# EAGLE board AK4493-v1.64_26 (EAGLE 9.6.2), part 1 of 2
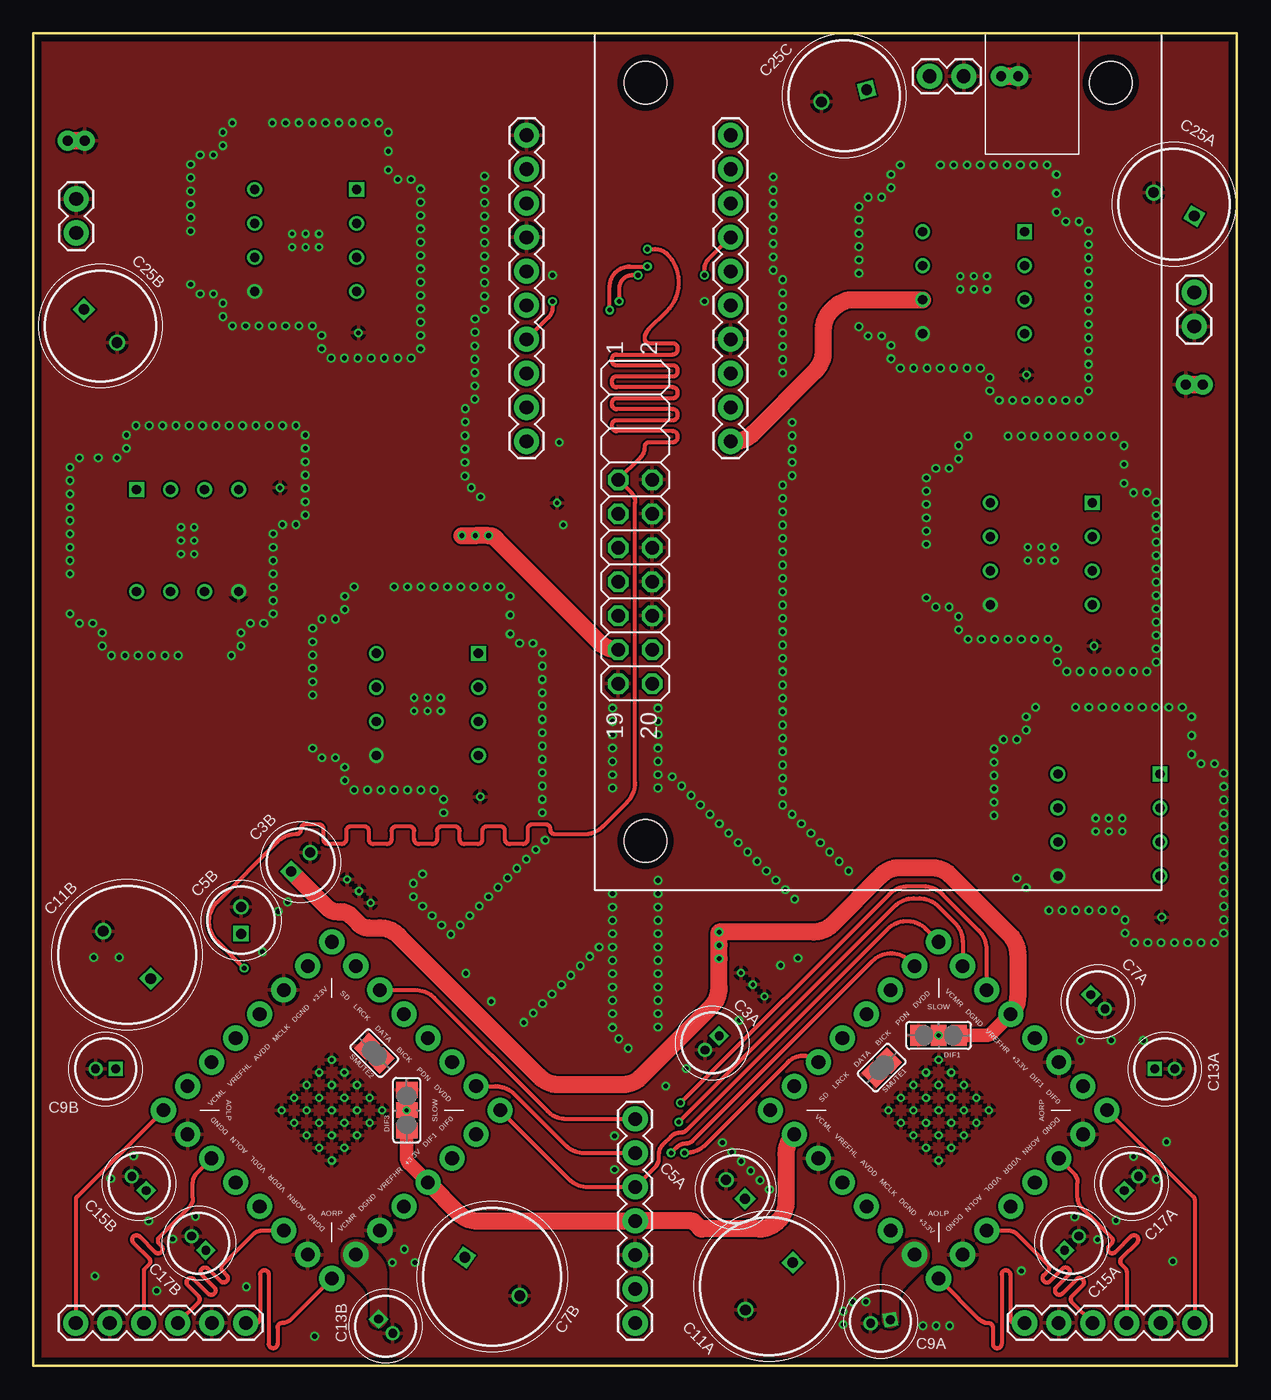
[diagram p2: board, top side]
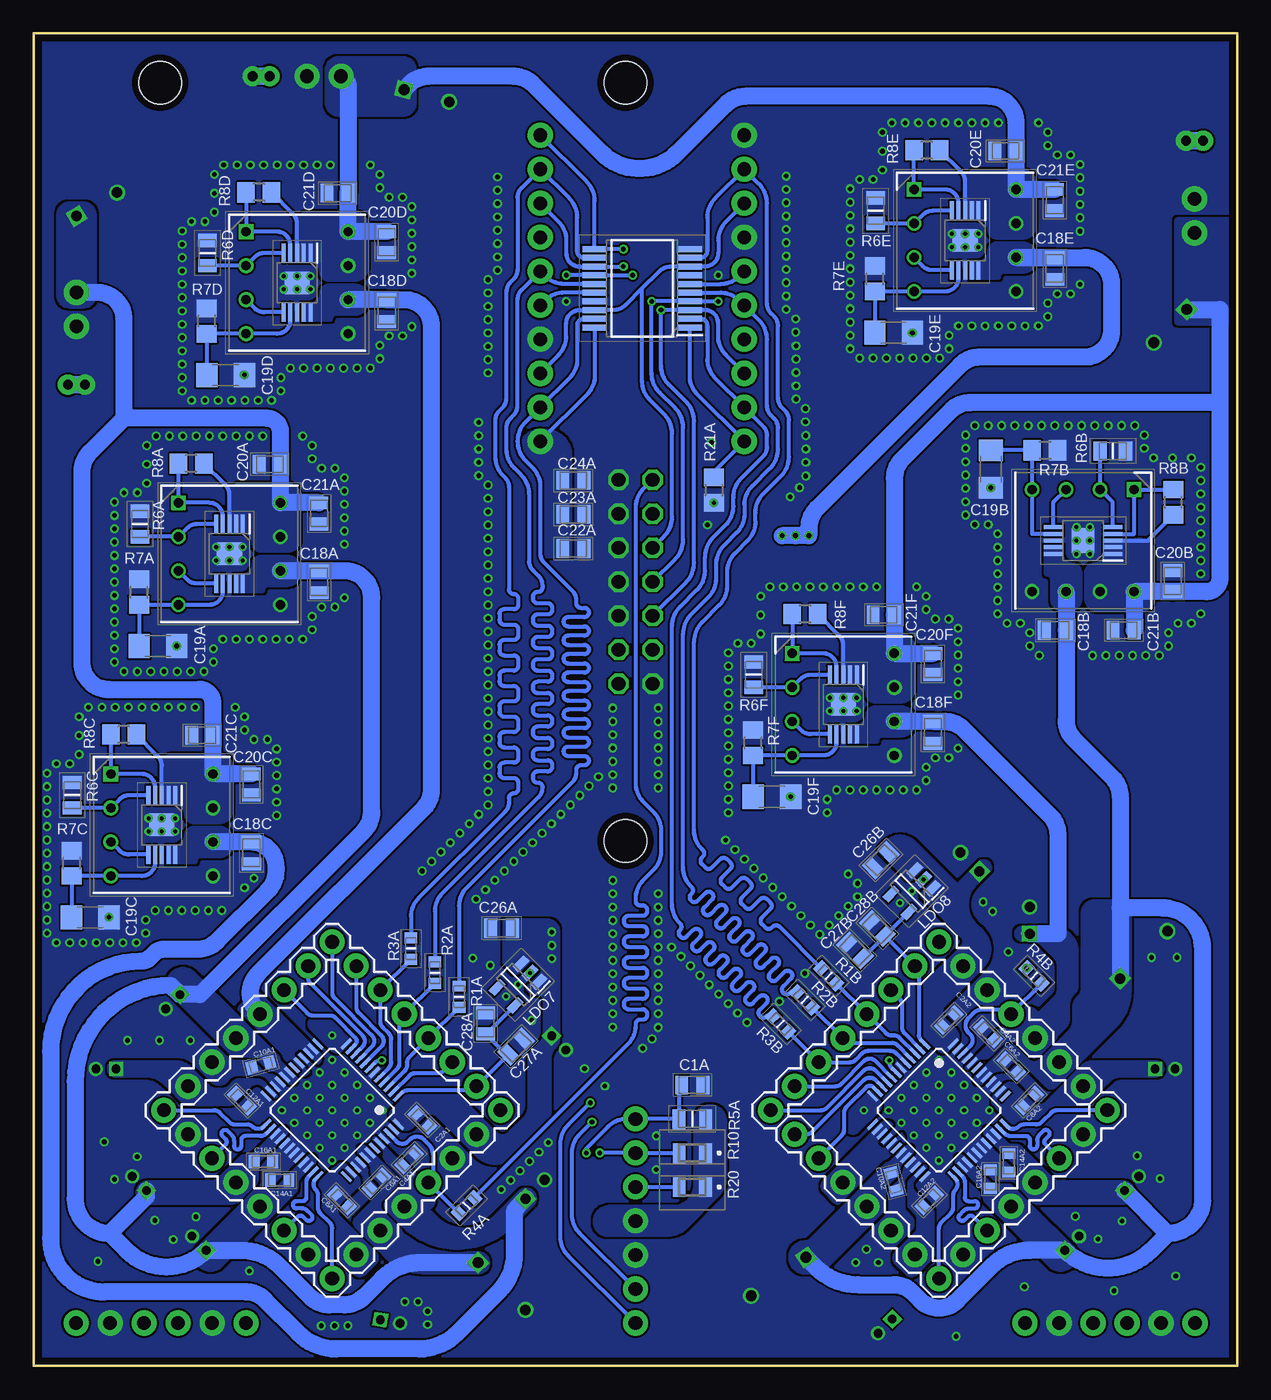
[diagram p3: board, bottom side, seen from below]

Size 89.89 x 99.5 mm. Coordinates in mm from the lower left corner, seen from the top.
Outline: 0,99.5 89.89,99.5 89.89,0 0,0 0,99.5
Copper layers (1*16): Top 0.035mm / dielectric 1.6mm / Bottom 0.035mm
Design rules "Elecrow_2-layer_PCB_eagle_rule": minimum track width 6mil, minimum drill 12mil, track to track 6mil, track to pad 6mil, pad to pad 6mil, via to via 8mil, smd to smd 0mil, copper to edge 20mil, drill to drill 10mil, minimum pad ring 6mil, minimum via ring 6mil, stop-mask expansion 0mil, vias tented up to drill 100mil, thermal gap 10mil
Net classes: 3 Power: width 1.27 mm, drill 1.27 mm, clearance 0.254 mm

## Footprints (pad centres in the part's own frame; a part is rotated, then mirrored left to right if it is on the bottom)
I2SOVERUSBV3 = drill 1.016 octagon: H3.7 33.322,1.745; H3.8 33.322,4.285; H3.9 35.862,1.745; H3.10 35.862,4.285; H3.11 38.403,1.745; H3.12 38.403,4.285; H3.13 40.943,1.745; H3.14 40.943,4.285; H3.15 43.483,1.745; H3.16 43.483,4.285; H3.17 46.023,1.745; H3.18 46.023,4.285; H3.19 48.562,1.745; H3.20 48.562,4.285 | hole 3.175: 3.688,3.775; 3.688,38.525; 60.312,3.775
CAPC2012X135N = smd 0.96 x 1.39: 1 -0.79,0; 2 0.79,0
CAPC1608X95N = smd 0.81 x 0.99: 1 -0.69,0; 2 0.69,0
CAPPRD150W45D450H600 = drill 0.65 pad 1.05 square: 1 0,0 | drill 0.65 pad 1.05: 2 1.5,0
CAPPRD200W55D500H800 = drill 0.75 pad 1.15 square: 1 0,0 | drill 0.75 pad 1.15: 2 2,0
CAPPRD500W60D1025H2150 = drill 0.8 pad 1.2 square: 1 0,0 | drill 0.8 pad 1.2: 2 5,0
CAPC2013X140N = smd 0.96 x 1.44: 1 -0.82,0; 2 0.82,0
C1206 = smd 1.6 x 1.8: 1 -1.4,0; 2 1.4,0 | drill 0.35: DGND 1.4,0
CAPPRD350W60D825H1300 = drill 0.8 pad 1.2 square: 1 0,0 | drill 0.8 pad 1.2: 2 3.5,0
SJ_2 = smd 1.168 x 1.6: 1 -1.524,0; 2 0,0; 3 1.524,0
SOP50P490X110-11N = smd 1.425 x 0.3: 1 -2.212,1; 2 -2.212,0.5; 3 -2.212,0; 4 -2.212,-0.5; 5 -2.212,-1; 6 2.212,-1; 7 2.212,-0.5; 8 2.212,0; 9 2.212,0.5; 10 2.212,1 | smd 1.68 x 1.88: 11 0,0 | drill 0.305 pad 0.61: P$1 -0.498,0; P$2 0.498,0; P$3 -0.498,0.995; P$4 0.498,0.995; P$5 -0.498,-0.995; P$6 0.498,-0.995
LQFP48_ = smd 0.25 x 1: 1 -2.75,-4.25; 2 -2.25,-4.25; 3 -1.75,-4.25; 4 -1.25,-4.25; 5 -0.75,-4.25; 6 -0.25,-4.25; 7 0.25,-4.25; 8 0.75,-4.25; 9 1.25,-4.25; 10 1.75,-4.25; 11 2.25,-4.25; 12 2.75,-4.25; 25 2.75,4.25; 26 2.25,4.25; 27 1.75,4.25; 28 1.25,4.25; 29 0.75,4.25; 30 0.25,4.25; 31 -0.25,4.25; 32 -0.75,4.25; 33 -1.25,4.25; 34 -1.75,4.25; 35 -2.25,4.25; 36 -2.75,4.25 | smd 1 x 0.25: 13 4.25,-2.75; 14 4.25,-2.25; 15 4.25,-1.75; 16 4.25,-1.25; 17 4.25,-0.75; 18 4.25,-0.25; 19 4.25,0.25; 20 4.25,0.75; 21 4.25,1.25; 22 4.25,1.75; 23 4.25,2.25; 24 4.25,2.75; 37 -4.25,2.75; 38 -4.25,2.25; 39 -4.25,1.75; 40 -4.25,1.25; 41 -4.25,0.75; 42 -4.25,0.25; 43 -4.25,-0.25; 44 -4.25,-0.75; 45 -4.25,-1.25; 46 -4.25,-1.75; 47 -4.25,-2.25; 48 -4.25,-2.75 | drill 0.305 pad 0.61: P$1 0,0; P$2 -1.327,0; P$3 -2.655,0; P$4 1.327,0; P$5 2.655,0; P$6 0,1.327; P$7 0,2.655; P$8 0,-1.327; P$9 0,-2.655; P$10 -1.327,-1.327; P$11 -2.655,-1.327; P$12 -2.655,-2.655; P$13 -1.327,-2.655; P$14 1.327,-2.655; P$15 2.655,-2.655; P$16 2.655,-1.327; P$17 1.327,-1.327; P$18 1.327,1.327; P$19 2.655,1.327; P$20 2.655,2.655; P$21 1.327,2.655; P$22 -1.327,2.655; P$23 -2.655,2.655; P$24 -2.655,1.327; P$25 -1.327,1.327
SOP65P780X200-20N = smd 1.8 x 0.45: 1 -3.55,2.925; 2 -3.55,2.275; 3 -3.55,1.625; 4 -3.55,0.975; 5 -3.55,0.325; 6 -3.55,-0.325; 7 -3.55,-0.975; 8 -3.55,-1.625; 9 -3.55,-2.275; 10 -3.55,-2.925; 11 3.55,-2.925; 12 3.55,-2.275; 13 3.55,-1.625; 14 3.55,-0.975; 15 3.55,-0.325; 16 3.55,0.325; 17 3.55,0.975; 18 3.55,1.625; 19 3.55,2.275; 20 3.55,2.925
1X02 = drill 1.016 pad 1.88: 1 0,0; 2 2.54,0
1X07 = drill 1.016 pad 1.88: 1 0,0; 2 2.54,0; 3 5.08,0; 4 7.62,0; 5 10.16,0; 6 12.7,0; 7 15.24,0
1X06 = drill 1.016 pad 1.88: 1 0,0; 2 2.54,0; 3 5.08,0; 4 7.62,0; 5 10.16,0; 6 12.7,0
DIPS762W51P254L1016H390Q8N = drill 0.7 pad 1.1 square: 1 0,0 | drill 0.7 pad 1.1: 2 0,-2.54; 3 0,-5.08; 4 0,-7.62; 5 7.62,-7.62; 6 7.62,-5.08; 7 7.62,-2.54; 8 7.62,0
1X10 = drill 1.016 pad 1.88: 1 0,0; 2 2.54,0; 3 5.08,0; 4 7.62,0; 5 10.16,0; 6 12.7,0; 7 15.24,0; 8 17.78,0; 9 20.32,0; 10 22.86,0
SOT95P280X145-5N = smd 1.2 x 0.6: 1 -1.25,0.95; 2 -1.25,0; 3 -1.25,-0.95; 4 1.25,-0.95; 5 1.25,0.95 | drill 0.305 pad 0.61: DGND -1.25,0; DGND2 0,0; DGND3 1.25,0
RESC1608X55N = smd 0.8 x 0.95: 1 -0.8,0; 2 0.8,0
RESC2012X50N = smd 0.95 x 1.45: 1 -1,0; 2 1,0
RESC2012X60N = smd 1 x 1.4: 1 -0.95,0; 2 0.95,0
R0805 = smd 1.3 x 1.5: 1 -0.95,0; 2 0.95,0
RCS0805_E3 = smd 0.95 x 1.45: 1 -0.975,0; 2 0.975,0
R0805-POL = smd 1.3 x 1.5: 1 -0.95,0; 2 0.95,0 | drill 0.305 pad 0.61: DGND 0.95,0
SHORT_ALL-50 = drill 0.737 pad 1.524: 1 -0.635,0; 2 0.635,0
SJ = smd 1.168 x 1.6: 1 -0.762,0; 2 0.762,0

## Placement (x,y rotation side)
BD1  I2SOVERUSBV3  [I2SOVERUSBV3]  41.93,99.5 270 top
C1A  0.1uF, X7R  [CAPC2012X135N]  40.7,20.97 0 bottom
C2A1  0.1u, Ceramic Capacitor X7R  [CAPC1608X95N]  60.87,18.35 315 bottom
C2A2  0.1u, Ceramic Capacitor X7R  [CAPC1608X95N]  21.55,25.82 45 bottom
C3A  80-A758BG106M1EAAE70  [CAPPRD150W45D450H600]  51.21,24.63 225 top
C3B  80-A758BG106M1EAAE70  [CAPPRD200W55D500H800]  19.25,36.9 45 top
C4A1  0.1u, Ceramic Capacitor X7R  [CAPC1608X95N]  61.86,15.42 45 bottom
C4A2  0.1u, Ceramic Capacitor X7R  [CAPC1608X95N]  18.62,24.83 135 bottom
C5A  80-A758BG106M1EAAE70  [CAPPRD200W55D500H800]  53.15,12.47 135 top
C5B  80-A758BG106M1EAAE70  [CAPPRD200W55D500H800]  15.5,32.26 90 top
C6A1  0.1u, Ceramic Capacitor X7R  [CAPC1608X95N]  64.3,13.68 225 bottom
C6A2  0.1u, Ceramic Capacitor X7R  [CAPC1608X95N]  16.88,22.39 315 bottom
C7A  RNU1A100MDSASQ  [CAPPRD150W45D450H600]  78.97,27.72 315 top
C7B  APSG160ELL222MJ20S  [CAPPRD500W60D1025H2150]  32.22,8.09 325 top
C8A1  0.1u, Ceramic Capacitor X7R  [CAPC1608X95N]  66.88,12.34 315 bottom
C8A2  0.1u, Ceramic Capacitor X7R  [CAPC1608X95N]  15.54,19.81 45 bottom
C9A  647-RNU1A100MDSASQ  [CAPPRD150W45D450H600]  64,3.44 190 top
C9B  647-RNU1A100MDSASQ  [CAPPRD150W45D450H600]  6.14,22.17 180 top
C10A1  0.1u, Ceramic Capacitor X7R  [CAPC1608X95N]  72.93,22.46 195 bottom
C10A2  0.1u, Ceramic Capacitor X7R  [CAPC1608X95N]  25.66,13.75 285 bottom
C11A  APSG160ELL222MJ20S  [CAPPRD500W60D1025H2150]  56.71,7.7 225 top
C11B  2200uF, 10V  [CAPPRD500W60D1025H2150]  8.75,28.92 135 top
C12A1  0.1u, Ceramic Capacitor X7R  [CAPC1608X95N]  74.34,19.8 315 bottom
C12A2  0.1u, Ceramic Capacitor X7R  [CAPC1608X95N]  23.01,12.34 45 bottom
C13A  647-RNU1A100MDSASQ  [CAPPRD150W45D450H600]  83.75,22.17 0 top
C13B  647-RNU1A100MDSASQ  [CAPPRD150W45D450H600]  25.77,3.49 315 top
C14A1  0.1u, Ceramic Capacitor X7R  [CAPC1608X95N]  71.53,13.86 180 bottom
C14A2  0.1u, Ceramic Capacitor X7R  [CAPC1608X95N]  17.06,15.15 270 bottom
C15A  647-RNU1A100MDSASQ  [CAPPRD150W45D450H600]  77.01,8.62 45 top
C15B  647-RNU1A100MDSASQ  [CAPPRD150W45D450H600]  8.41,13.08 135 top
C16A1  0.1u, Ceramic Capacitor X7R  [CAPC1608X95N]  72.74,15.24 0 bottom
C16A2  0.1u, Ceramic Capacitor X7R  [CAPC1608X95N]  18.45,13.95 90 bottom
C17A  647-RNU1A100MDSASQ  [CAPPRD150W45D450H600]  81.48,13.08 45 top
C17B  647-RNU1A100MDSASQ  [CAPPRD150W45D450H600]  12.88,8.62 135 top
C18A  4.7u  [CAPC2013X140N]  68.58,58.55 270 bottom
C18B  4.7u  [CAPC2013X140N]  13.6,54.93 180 bottom
C18C  4.7u  [CAPC2013X140N]  73.63,38.3 270 bottom
C18D  4.7u  [CAPC2013X140N]  63.53,78.8 270 bottom
C18E  4.7u  [CAPC2013X140N]  13.63,81.95 270 bottom
C18F  4.7u  [CAPC2013X140N]  22.73,47.3 270 bottom
C19A  22u  [C1206]  80.62,53.74 0 bottom
C19B  22u  [C1206]  18.41,66.97 270 bottom
C19C  22u  [C1206]  85.67,33.49 0 bottom
C19D  22u  [C1206]  75.57,73.99 0 bottom
C19E  22u  [C1206]  25.67,77.14 0 bottom
C19F  22u  [C1206]  34.77,42.49 0 bottom
C20A  10u  [CAPC2012X135N]  72.26,67.33 180 bottom
C20B  10u  [CAPC2012X135N]  4.82,58.61 90 bottom
C20C  10u  [CAPC2012X135N]  73.63,43.41 270 bottom
C20D  10u  [CAPC2012X135N]  63.53,83.91 270 bottom
C20E  10u  [CAPC2012X135N]  17.31,90.73 180 bottom
C20F  10u  [CAPC2012X135N]  22.73,52.41 270 bottom
C21A  0.1u  [CAPC2012X135N]  68.58,63.66 270 bottom
C21B  0.1u  [CAPC2012X135N]  8.49,54.93 180 bottom
C21C  0.1u  [CAPC2012X135N]  77.31,47.08 180 bottom
C21D  0.1u  [CAPC2012X135N]  67.21,87.58 180 bottom
C21E  0.1u  [CAPC2012X135N]  13.63,87.06 270 bottom
C21F  0.1u  [CAPC2012X135N]  26.41,56.08 180 bottom
C22A  0.1u, Ceramic Capacitor X7R  [CAPC2012X135N]  49.59,61.03 0 bottom
C23A  0.1u, Ceramic Capacitor X7R  [CAPC2012X135N]  49.59,63.57 0 bottom
C24A  0.1u, Ceramic Capacitor X7R  [CAPC2012X135N]  49.59,66.11 0 bottom
C25A  470u  [CAPPRD350W60D825H1300]  86.7,85.87 150 top
C25B  470u  [CAPPRD350W60D825H1300]  3.77,78.89 315 top
C25C  470u  [CAPPRD350W60D825H1300]  62.24,95.3 195 top
C26A  4.7u, Ceramic Capacitor X7R  [CAPC2013X140N]  54.96,32.68 180 bottom
C26B  4.7u, Ceramic Capacitor X7R  [CAPC2013X140N]  26.62,37.76 225 bottom
C27A  4.7u, Ceramic Capacitor X7R  [CAPC2013X140N]  53.87,23.84 45 bottom
C27B  4.7u, Ceramic Capacitor X7R  [CAPC2013X140N]  28.55,31.02 135 bottom
C28A  0.1u, Ceramic Capacitor X7R  [CAPC2012X135N]  56.14,25.57 90 bottom
C28B  0.1u, Ceramic Capacitor X7R  [CAPC2012X135N]  26.87,32.66 135 bottom
DIF1  [SJ_2]  67.61,24.67 0 top
DIF3  [SJ_2]  27.88,19.08 270 top
IC1  LT3042  [SOP50P490X110-11N]  75.28,60.64 270 bottom
IC2  AK4493  [LQFP48_]  67.61,19.08 135 bottom
IC3  AK4493  [LQFP48_]  22.28,19.08 225 bottom
IC4  LT3042  [SOP50P490X110-11N]  80.33,40.39 270 bottom
IC4A  SN74ABT273DBR  [SOP65P780X200-20N]  44.44,80.47 180 bottom
IC5  LT3042  [SOP50P490X110-11N]  11.51,61.63 180 bottom
IC6  LT3042  [SOP50P490X110-11N]  70.23,80.89 270 bottom
IC7  LT3042  [SOP50P490X110-11N]  29.43,49.39 270 bottom
IC8  LT3042  [SOP50P490X110-11N]  20.33,84.04 270 bottom
J1  [1X02]  3.19,84.6 90 top
J2  [1X02]  66.94,96.31 0 top
J3  [1X07]  44.94,18.43 270 top
J4  [1X06]  74.03,3.19 0 top
J5  [1X07]  80.18,19.08 45 bottom
J6  [1X07]  67.61,6.51 135 bottom
J7  [1X07]  55.03,19.08 225 bottom
J8  [1X07]  67.61,31.65 315 bottom
J9  [1X07]  22.28,6.51 135 bottom
J10  [1X07]  9.71,19.08 225 bottom
J11  [1X07]  22.28,31.65 315 bottom
J12  [1X07]  34.85,19.08 45 bottom
J13  [1X06]  3.16,3.19 0 top
J14  [1X02]  86.7,80.16 270 top
J15  XR2A-0811-N  [DIPS762W51P254L1016H390Q8N]  79.09,64.45 0 bottom
J16  XR2A-0811-N  [DIPS762W51P254L1016H390Q8N]  84.14,44.2 0 bottom
J17  XR2A-0811-N  [DIPS762W51P254L1016H390Q8N]  7.7,65.44 270 bottom
J18  XR2A-0811-N  [DIPS762W51P254L1016H390Q8N]  74.04,84.7 0 bottom
J19  XR2A-0811-N  [DIPS762W51P254L1016H390Q8N]  33.24,53.2 0 bottom
J20  XR2A-0811-N  [DIPS762W51P254L1016H390Q8N]  24.14,87.85 0 bottom
J21  [1X10]  36.82,91.9 270 top
J22  [1X10]  52.06,69.04 90 top
LDO7  LP5907-1.8V  [SOT95P280X145-5N]  53.72,28.46 225 bottom
LDO8  LP5907-1.8V  [SOT95P280X145-5N]  24.31,35.44 225 bottom
R1A  RT0603DRE075R1L  [RESC1608X55N]  58.13,27.56 270 bottom
R1B  RT0603DRE075R1L  [RESC1608X55N]  30.53,29.12 315 bottom
R2A  RT0603DRE075R1L  [RESC1608X55N]  59.93,29.35 270 bottom
R2B  RT0603DRE075R1L  [RESC1608X55N]  32.32,27.32 315 bottom
R3A  RT0603DRE075R1L  [RESC1608X55N]  61.72,31.15 270 bottom
R3B  RT0603DRE075R1L  [RESC1608X55N]  34.12,25.53 315 bottom
R4A  RT0603DRE075R1L  [RESC1608X55N]  57.57,11.96 225 bottom
R4B  RT0603DRE075R1L  [RESC1608X55N]  15.17,29.12 315 bottom
R5A  10K, Resistor 1%  [RESC2012X50N]  40.7,18.43 0 bottom
R6A  1k  [RESC2012X60N]  81.97,62.86 90 bottom
R6B  1k  [RESC2012X60N]  9.29,68.32 0 bottom
R6C  1k  [RESC2012X60N]  87.02,42.61 90 bottom
R6D  1k  [RESC2012X60N]  76.92,83.11 90 bottom
R6E  1k  [RESC2012X60N]  27.02,86.26 90 bottom
R6F  1k  [RESC2012X60N]  36.12,51.61 90 bottom
R7A  33k  [R0805]  82.02,57.78 90 bottom
R7B  33k  [R0805]  14.37,68.37 0 bottom
R7C  33k  [R0805]  87.07,37.53 90 bottom
R7D  33k  [R0805]  76.97,78.03 90 bottom
R7E  33k  [R0805]  27.07,81.18 90 bottom
R7F  33k  [R0805]  36.17,46.53 90 bottom
R8A  200k  [R0805]  78.14,67.38 180 bottom
R8B  200k  [R0805]  4.77,64.49 90 bottom
R8C  200k  [R0805]  83.19,47.13 180 bottom
R8D  200k  [R0805]  73.09,87.63 180 bottom
R8E  200k  [R0805]  23.19,90.78 180 bottom
R8F  200k  [R0805]  32.29,56.13 180 bottom
R10  2.2k, 1%  [RCS0805_E3]  40.7,15.89 180 bottom
R20  2.2k, 1%  [RCS0805_E3]  40.7,13.35 180 bottom
R21A  Not Pop.  [R0805-POL]  39.1,65.39 270 bottom
SH1  SHORTA5  [SHORT_ALL-50]  3.19,91.49 180 top
SH2  SHORTA5  [SHORT_ALL-50]  72.91,96.31 180 top
SH3  SHORTA5  [SHORT_ALL-50]  86.7,73.27 0 top
SMUTE1  [SJ]  63.35,22.26 225 top
SMUTE2  [SJ]  25.46,23.33 135 top